# Altium schematic sheet XT Wonder.SchDoc
size 863 x 558 mm; SheetNumber: 1; SheetTotal: 1
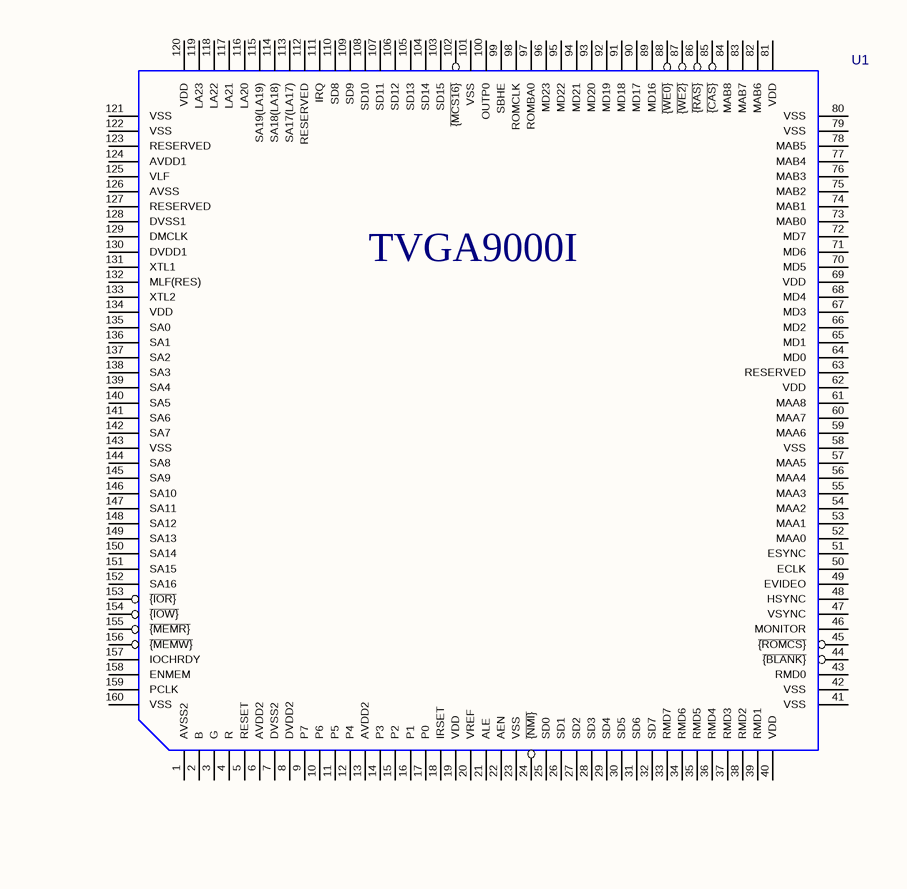
[diagram p0: XT Wonder.SchDoc, top]
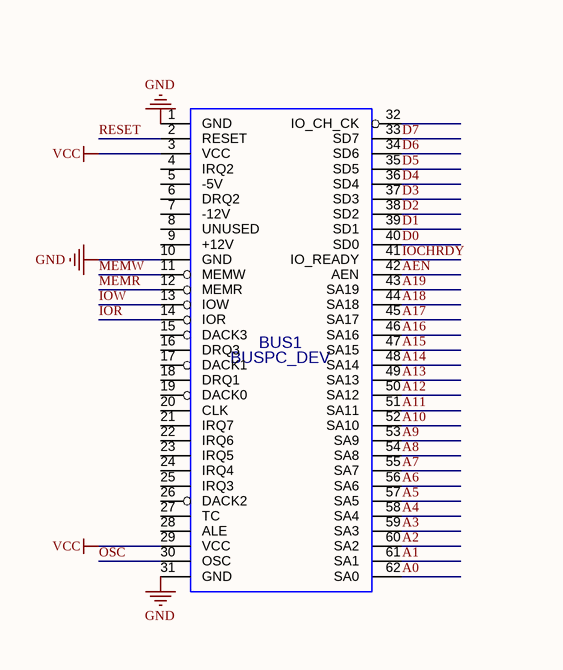
[diagram p1: XT Wonder.SchDoc, bottom]

## Parts
BUS1  BUSPC_DEV  [Conn_Edge_ISA8]
U1  TVGA9000I  [TVGA9000]

## Nets
GND: BUS1.1(GND) BUS1.10(GND) BUS1.31(GND)
VCC: BUS1.3(VCC) BUS1.29(VCC)
A0: BUS1.62(SA0)
A1: BUS1.61(SA1)
A2: BUS1.60(SA2)
A3: BUS1.59(SA3)
A4: BUS1.58(SA4)
A5: BUS1.57(SA5)
A6: BUS1.56(SA6)
A7: BUS1.55(SA7)
A8: BUS1.54(SA8)
A9: BUS1.53(SA9)
A10: BUS1.52(SA10)
A11: BUS1.51(SA11)
A12: BUS1.50(SA12)
A13: BUS1.49(SA13)
A14: BUS1.48(SA14)
A15: BUS1.47(SA15)
A16: BUS1.46(SA16)
A17: BUS1.45(SA17)
A18: BUS1.44(SA18)
A19: BUS1.43(SA19)
AEN: BUS1.42(AEN)
D0: BUS1.40(SD0)
D1: BUS1.39(SD1)
D2: BUS1.38(SD2)
D3: BUS1.37(SD3)
D4: BUS1.36(SD4)
D5: BUS1.35(SD5)
D6: BUS1.34(SD6)
D7: BUS1.33(SD7)
IOCHRDY: BUS1.41(IO_READY)
IOR: BUS1.14(IOR)
IOW: BUS1.13(IOW)
MEMR: BUS1.12(MEMR)
MEMW: BUS1.11(MEMW)
OSC: BUS1.30(OSC)
RESET: BUS1.2(RESET)

Not connected (* = marked no-connect by the designer): BUS1 4(IRQ2) 5(-5V) 6(DRQ2) 7(-12V) 8(UNUSED) 9(+12V) 15(DACK3) 16(DRQ3) 17(DACK1) 18(DRQ1) 19(DACK0) 20(CLK) 21(IRQ7) 22(IRQ6) 23(IRQ5) 24(IRQ4) 25(IRQ3) 26(DACK2) 27(TC) 28(ALE) 32(IO_CH_CK); U1 1(AVSS2) 2(B) 3(G) 4(R) 5(RESET) 6(AVDD2) 7(DVSS2) 8(DVDD2) 9(P7) 10(P6) 11(P5) 12(P4) 13(AVDD2) 14(P3) 15(P2) 16(P1) 17(P0) 18(IRSET) 19(VDD) 20(VREF) 21(ALE) 22(AEN) 23(VSS) 24(~{{NMI}}) 25(SD0) 26(SD1) 27(SD2) 28(SD3) 29(SD4) 30(SD5) 31(SD6) 32(SD7) 33(RMD7) 34(RMD6) 35(RMD5) 36(RMD4) 37(RMD3) 38(RMD2) 39(RMD1) 40(VDD) 41(VSS) 42(VSS) 43(RMD0) 44(~{{BLANK}}) 45(~{{ROMCS}}) 46(MONITOR) 47(VSYNC) 48(HSYNC) 49(EVIDEO) 50(ECLK) 51(ESYNC) 52(MAA0) 53(MAA1) 54(MAA2) 55(MAA3) 56(MAA4) 57(MAA5) 58(VSS) 59(MAA6) 60(MAA7) 61(MAA8) 62(VDD) 63(RESERVED) 64(MD0) 65(MD1) 66(MD2) 67(MD3) 68(MD4) 69(VDD) 70(MD5) 71(MD6) 72(MD7) 73(MAB0) 74(MAB1) 75(MAB2) 76(MAB3) 77(MAB4) 78(MAB5) 79(VSS) 80(VSS) 81(VDD) 82(MAB6) 83(MAB7) 84(MAB8) 85(~{{CAS}}) 86(~{{RAS}}) 87(~{{WE2}}) 88(~{{WE0}}) 89(MD16) 90(MD17) 91(MD18) 92(MD19) 93(MD20) 94(MD21) 95(MD22) 96(MD23) 97(ROMBA0) 98(ROMCLK) 99(SBHE) 100(OUTP0) 101(VSS) 102(~{{MCS16}}) 103(SD15) 104(SD14) 105(SD13) 106(SD12) 107(SD11) 108(SD10) 109(SD9) 110(SD8) 111(IRQ) 112(RESERVED) 113(SA17(LA17)) 114(SA18(LA18)) 115(SA19(LA19)) 116(LA20) 117(LA21) 118(LA22) 119(LA23) 120(VDD) 121(VSS) 122(VSS) 123(RESERVED) 124(AVDD1) 125(VLF) 126(AVSS) 127(RESERVED) 128(DVSS1) 129(DMCLK) 130(DVDD1) 131(XTL1) 132(MLF(RES)) 133(XTL2) 134(VDD) 135(SA0) 136(SA1) 137(SA2) 138(SA3) 139(SA4) 140(SA5) 141(SA6) 142(SA7) 143(VSS) 144(SA8) 145(SA9) 146(SA10) 147(SA11) 148(SA12) 149(SA13) 150(SA14) 151(SA15) 152(SA16) 153(~{{IOR}}) 154(~{{IOW}}) 155(~{{MEMR}}) 156(~{{MEMW}}) 157(IOCHRDY) 158(ENMEM) 159(PCLK) 160(VSS)

## Notes on the sheet
- DWG. NO.
- REV.
- SHT.
- REVISION
- DESCRIPTION
- DATE
- APPROVED
- THIS DOCUMENT AND THE DATA DISCLOSED HEREIN OR HEREWITH IS THE PROPERTY OF ALTIUM LIMITED AND MAY BE FREELY DISTRIBUTED IN WHOLE. NO RIGHTS ARE RESERVED OR EXPRESS OR IMPLIED WARANTEE GIVEN.
- ENG:
- DSN:
- APPROVALS
- PROJECT
- DOCUMENT REVISION:
- DESIGN ITEM:
- CHK:
- BOM:
- REFERENCE DOCUMENTS
- PROJECT REVISION:
- TITLE
- FAB DWG:
- PCB DWG:
- ASSY DWG:
- SCALE:
- SIZE
- D
- CAGE CODE
- FILE NAME
- DWG NO.
- SHEET
- OF
- REV

## Library data of the parts
BUS1 = BUSPC_DEV: Value: BUSPC_DEV; Footprint: my_components:Conn_Edge_ISA8
U1 = TVGA9000I: Value: TVGA9000I